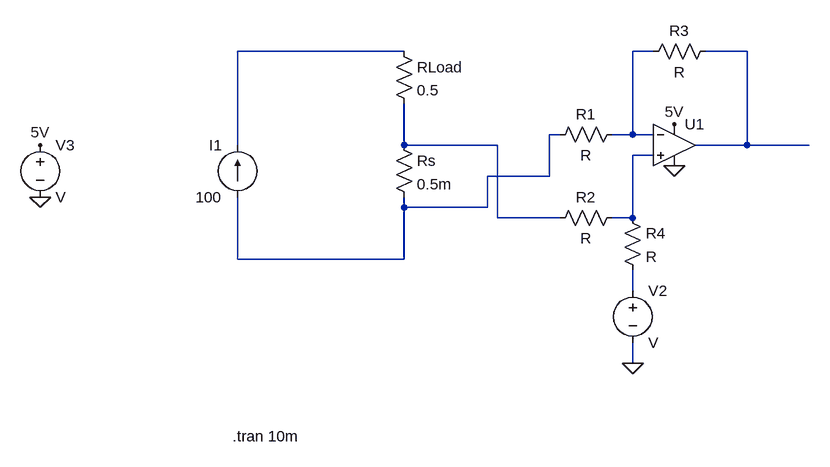
[diagram p0: schematic tbri557_sim.asc]
tbri557_sim.asc, the LTspice schematic file:
Version 4.1
SHEET 1 884 680
WIRE 256 -16 0 -16
WIRE 640 -16 608 -16
WIRE 784 -16 720 -16
WIRE 496 112 480 112
WIRE 608 112 608 -16
WIRE 608 112 576 112
WIRE 640 112 608 112
WIRE 0 128 0 -16
WIRE 256 128 256 64
WIRE 400 128 256 128
WIRE 784 128 784 -16
WIRE 784 128 704 128
WIRE 880 128 784 128
WIRE 640 144 608 144
WIRE 480 176 480 112
WIRE 480 176 384 176
WIRE 256 224 256 208
WIRE 384 224 384 176
WIRE 384 224 256 224
WIRE 400 240 400 128
WIRE 496 240 400 240
WIRE 608 240 608 144
WIRE 608 240 576 240
WIRE 0 304 0 208
WIRE 256 304 256 224
WIRE 256 304 0 304
WIRE 608 352 608 320
WIRE 608 464 608 432
FLAG 608 464 0
FLAG 672 160 0
FLAG -304 128 5V
FLAG -304 208 0
FLAG 672 96 5V
SYMBOL res 240 -32 R0
SYMATTR InstName RLoad
SYMATTR Value 0.5
SYMBOL res 240 112 R0
SYMATTR InstName Rs
SYMATTR Value 0.5m
SYMBOL res 592 96 R90
WINDOW 0 0 56 VBottom 2
WINDOW 3 32 56 VTop 2
SYMATTR InstName R1
SYMBOL res 592 224 R90
WINDOW 0 0 56 VBottom 2
WINDOW 3 32 56 VTop 2
SYMATTR InstName R2
SYMBOL OpAmps\\UniversalOpAmp2 672 128 R0
SYMATTR InstName U1
SYMBOL res 736 -32 R90
WINDOW 0 0 56 VBottom 2
WINDOW 3 32 56 VTop 2
SYMATTR InstName R3
SYMBOL res 592 224 R0
SYMATTR InstName R4
SYMBOL voltage 608 336 R0
SYMATTR InstName V2
SYMBOL voltage -304 112 R0
SYMATTR InstName V3
SYMBOL current 0 208 R180
WINDOW 0 24 80 Left 2
WINDOW 3 24 0 Left 2
WINDOW 123 0 0 Left 0
WINDOW 39 0 0 Left 0
SYMATTR InstName I1
SYMATTR Value 100
TEXT -8 576 Left 2 !.tran 10m

The netlist it stands for:
* tbri557_sim.asc
RLoad N001 N005 0.5
Rs N005 N004 0.5m
R1 N002 N004 R
R2 N006 N005 R
X§U1 N006 N002 5V 0 N003 level2 Avol=1Meg GBW=10Meg Slew=10Meg Ilimit=25m Rail=0 Vos=0 En=0 Enk=0 In=0 Ink=0 Rin=500Meg  ; pins In+ In- V+ V- OUT
R3 N003 N002 R
R4 N006 N007 R
V2 N007 0 V
V3 5V 0 V
I1 N004 N001 100
.tran 10m
.lib UniversalOpAmp2.lib
.backanno
.end